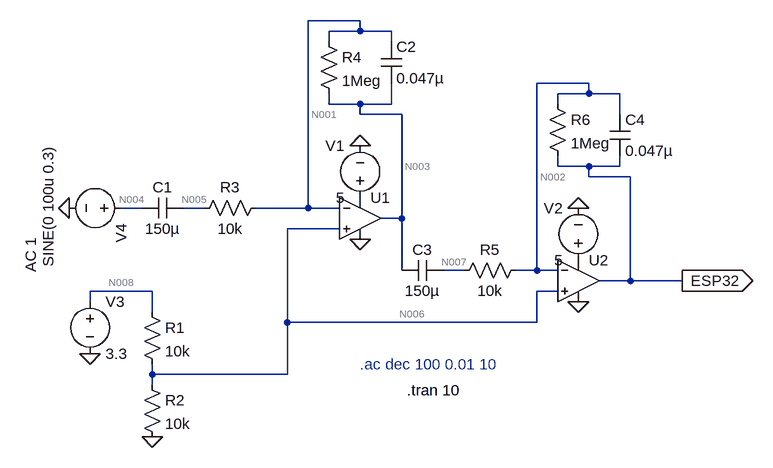
[diagram p0: schematic HB100-ESP32.asc]
HB100-ESP32.asc, the LTspice schematic file:
Version 4
SHEET 1 1220 680
WIRE 112 -144 32 -144
WIRE 112 -128 112 -144
WIRE 112 -128 64 -128
WIRE 160 -128 112 -128
WIRE 64 -112 64 -128
WIRE 160 -112 160 -128
WIRE 464 -48 384 -48
WIRE 464 -32 464 -48
WIRE 464 -32 416 -32
WIRE 512 -32 464 -32
WIRE 64 -16 64 -32
WIRE 112 -16 64 -16
WIRE 160 -16 160 -48
WIRE 160 -16 112 -16
WIRE 416 -16 416 -32
WIRE 112 0 112 -16
WIRE 176 0 112 0
WIRE 512 0 512 -32
WIRE 416 80 416 64
WIRE 464 80 416 80
WIRE 512 80 512 64
WIRE 512 80 464 80
WIRE 464 96 464 80
WIRE 528 96 464 96
WIRE -224 144 -256 144
WIRE -128 144 -160 144
WIRE 32 144 32 -144
WIRE 32 144 -48 144
WIRE 80 144 32 144
WIRE 176 160 176 0
WIRE 176 160 144 160
WIRE 80 176 0 176
WIRE 176 240 176 160
WIRE 272 240 240 240
WIRE 384 240 384 -48
WIRE 384 240 352 240
WIRE 416 240 384 240
WIRE 528 256 528 96
WIRE 528 256 480 256
WIRE 608 256 528 256
WIRE -208 272 -304 272
WIRE 416 272 384 272
WIRE -304 288 -304 272
WIRE -208 304 -208 272
WIRE 0 320 0 176
WIRE 384 320 384 272
WIRE 384 320 0 320
WIRE -208 400 -208 384
WIRE 0 400 0 320
WIRE 0 400 -208 400
WIRE -208 416 -208 400
FLAG 112 192 0
FLAG 448 288 0
FLAG 112 48 0
FLAG 448 144 0
FLAG -304 368 0
FLAG -208 496 0
FLAG -336 144 0
FLAG 608 256 ESP32
IOPIN 608 256 Out
SYMBOL voltage 112 144 R180
WINDOW 0 24 96 Left 2
WINDOW 3 24 16 Left 2
WINDOW 123 0 0 Left 0
WINDOW 39 0 0 Left 0
SYMATTR InstName V1
SYMATTR Value 5
SYMBOL voltage 448 240 R180
WINDOW 0 24 96 Left 2
WINDOW 3 24 16 Left 2
WINDOW 123 0 0 Left 0
WINDOW 39 0 0 Left 0
SYMATTR InstName V2
SYMATTR Value 5
SYMBOL voltage -304 272 R0
WINDOW 123 0 0 Left 0
WINDOW 39 0 0 Left 0
SYMATTR InstName V3
SYMATTR Value 3.3
SYMBOL res -224 288 R0
SYMATTR InstName R1
SYMATTR Value 10k
SYMBOL res -224 400 R0
SYMATTR InstName R2
SYMATTR Value 10k
SYMBOL voltage -240 144 R90
WINDOW 3 -96 128 Left 2
WINDOW 123 46 155 Left 2
WINDOW 39 0 0 Left 0
SYMATTR Value SINE(0 100u 0.3)
SYMATTR Value2 AC 1
SYMATTR InstName V4
SYMBOL cap -160 128 R90
WINDOW 0 0 32 VBottom 2
WINDOW 3 32 32 VTop 2
SYMATTR InstName C1
SYMATTR Value 150µ
SYMBOL res -32 128 R90
WINDOW 0 0 56 VBottom 2
WINDOW 3 32 56 VTop 2
SYMATTR InstName R3
SYMATTR Value 10k
SYMBOL res 48 -128 R0
SYMATTR InstName R4
SYMATTR Value 1Meg
SYMBOL cap 144 -112 R0
SYMATTR InstName C2
SYMATTR Value 0.047µ
SYMBOL res 256 256 R270
WINDOW 0 32 56 VTop 2
WINDOW 3 0 56 VBottom 2
SYMATTR InstName R5
SYMATTR Value 10k
SYMBOL res 400 -32 R0
SYMATTR InstName R6
SYMATTR Value 1Meg
SYMBOL cap 240 224 R90
WINDOW 0 0 32 VBottom 2
WINDOW 3 32 32 VTop 2
SYMATTR InstName C3
SYMATTR Value 150µ
SYMBOL cap 496 0 R0
SYMATTR InstName C4
SYMATTR Value 0.047µ
SYMBOL OpAmps\\UniversalOpAmp2 112 160 R0
SYMATTR InstName U1
SYMBOL OpAmps\\UniversalOpAmp2 448 256 R0
SYMATTR InstName U2
TEXT 112 384 Left 2 ;.ac dec 100 0.01 10
TEXT 184 424 Left 2 !.tran 10

The netlist it stands for:
* HB100-ESP32.asc
V1 P001 0 5
V2 P002 0 5
V3 N008 0 3.3
R1 N008 N006 10k
R2 N006 0 10k
V4 N004 0 SINE(0 100u 0.3) AC 1
C1 N005 N004 150µ
R3 N001 N005 10k
R4 N001 N003 1Meg
C2 N001 N003 0.047µ
R5 N007 N002 10k
R6 N002 ESP32 1Meg
C3 N007 N003 150µ
C4 N002 ESP32 0.047µ
XU1 N006 N001 P001 0 N003 level2 Avol=1Meg GBW=10Meg Slew=10Meg Ilimit=25m Rail=0 Vos=0 En=0 Enk=0 In=0 Ink=0 Rin=500Meg  ; pins In+ In- V+ V- OUT
XU2 N006 N002 P002 0 ESP32 level2 Avol=1Meg GBW=10Meg Slew=10Meg Ilimit=25m Rail=0 Vos=0 En=0 Enk=0 In=0 Ink=0 Rin=500Meg  ; pins In+ In- V+ V- OUT
* .ac dec 100 0.01 10
.tran 10
.lib UniversalOpAmp2.lib
.backanno
.end

* Results of the author's LTspice run, read from the files saved beside the schematic
* Operating Point, zero values left out:
*   V(p001) = 5 V
*   V(p002) = 5 V
*   V(n008) = 3.3 V
*   V(n006) = 1.65 V
*   V(n005) = 1.65 V
*   V(n001) = 1.65 V
*   V(n003) = 1.648 V
*   V(n007) = 1.65 V
*   V(n002) = 1.65 V
*   V(esp32) = 1.648 V
*   I(R1) = 165 µA
*   I(R2) = 165 µA
*   I(R4) = 1.7 nA
*   I(R6) = 1.7 nA
*   I(V1) = -235.1 µA
*   I(V2) = -235.1 µA
*   I(V3) = -165 µA
*   Ix(u1:1) = -1.7 nA
*   Ix(u1:2) = -1.7 nA
*   Ix(u1:3) = 235.1 µA
*   Ix(u1:4) = -235.1 µA
*   Ix(u1:5) = 1.7 nA
*   Ix(u2:1) = -1.7 nA
*   Ix(u2:2) = -1.7 nA
*   Ix(u2:3) = 235.1 µA
*   Ix(u2:4) = -235.1 µA
*   Ix(u2:5) = 1.7 nA
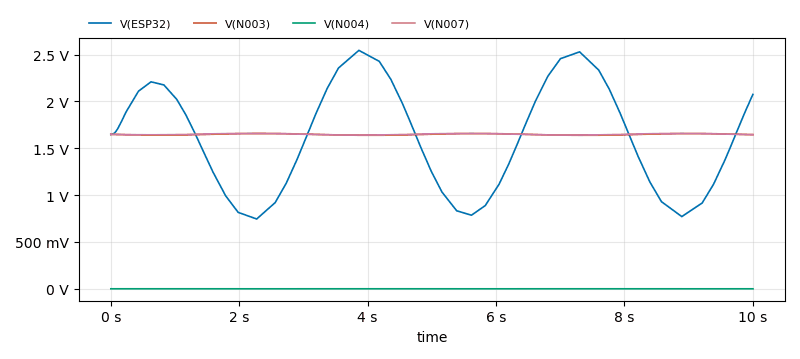
[diagram p1: Transient Analysis of HB100-ESP32.asc, plotted from the saved traces]
* Transient Analysis, 1 run:
*   V(ESP32): min 745.3 mV, max 2.546 V, average 1.607 V, rms 1.711 V, last 2.075 V
*   V(N003): min 1.639 V, max 1.658 V, average 1.649 V, rms 1.649 V, last 1.646 V
*   V(N004): min -99.98 µV, max 99.98 µV, average 11.11 nV, rms 70.31 µV, last 0 V
*   V(N007): min 1.641 V, max 1.659 V, average 1.65 V, rms 1.65 V, last 1.645 V